# Altium schematic sheet SPItoLVDS.SchDoc: PMOD SPI <> LVDS
size Letter; Revision: 1; SheetNumber: 1; SheetTotal: 1; Client: Facebook; LeaflabsProject: Sawyer
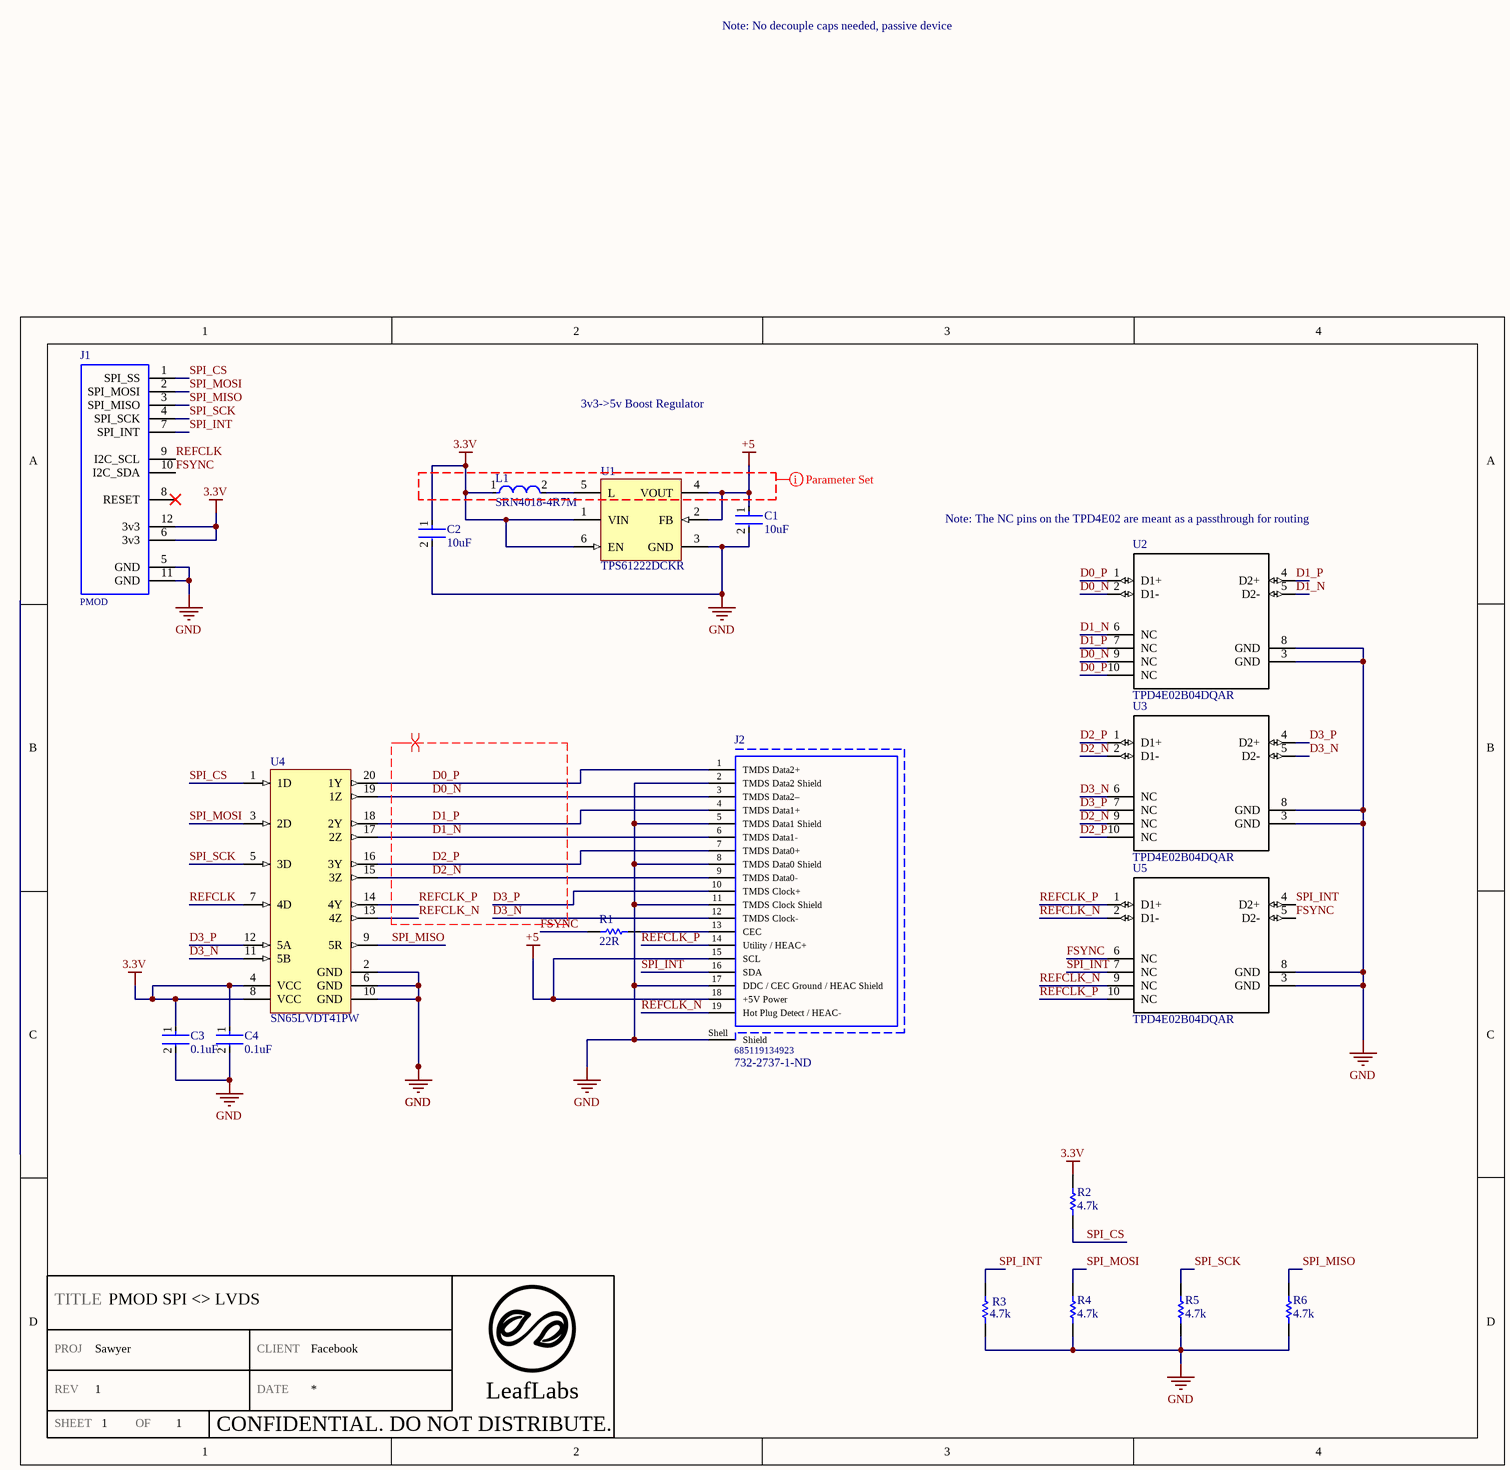
[diagram p0: SPItoLVDS.SchDoc]

## Parts
C1  10uF  [FP-CC0603-DA-IPC_B]
C2  10uF  [FP-CC0603-DA-IPC_B]
C3  0.1uF  [FP-CC0603-DA-IPC_B]
C4  0.1uF  [FP-CC0603-DA-IPC_B]
J1  PMOD  [PMOD]
J2  685119134923  Supplier Part Number 1: 732-2737-1-ND  [685119134923]
L1  SRN4018-4R7M  [FP-SRN4018-MFG]
R1  22R  [RESC1609X50X30NL10T20]
R2  4.7k  [RESC1609X50X30NL10T20]
R3  4.7k  [RESC1609X50X30NL10T20]
R4  4.7k  [RESC1609X50X30NL10T20]
R5  4.7k  [RESC1609X50X30NL10T20]
R6  4.7k  [RESC1609X50X30NL10T20]
U1  TPS61222DCKR  [SOT363_L]
U2  TPD4E02B04DQAR  [DQA0010A]
U3  TPD4E02B04DQAR  [DQA0010A]
U4  SN65LVDT41PW  [PW0020A_L]
U5  TPD4E02B04DQAR  [DQA0010A]

## Nets
3.3V: C2.1 C3.1 C4.1 J1.6(3v3) J1.12(3v3) L1.1 R2.2 U1.1(VIN) U1.6(EN) U4.4(VCC) U4.8(VCC)
+5: C1.1 J2.15(SCL) J2.18(+5V_Power) U1.2(FB) U1.4(VOUT)
GND: C1.2 C2.2 C3.2 C4.2 J1.5(GND) J1.11(GND) J2.2(TMDS_Data2_Shield) J2.5(TMDS_Data1_Shield) J2.8(TMDS_Data0_Shield) J2.11(TMDS_Clock_Shield) J2.17(DDC_/_CEC_Ground_/_HEAC_Shield) J2.Shell(Shield) R3.1 R4.1 R5.1 R6.1 U1.3(GND) U2.3(GND) U2.8(GND) U3.3(GND) U3.8(GND) U4.2(GND) U4.6(GND) U4.10(GND) U5.3(GND) U5.8(GND)
D0_N: J2.3(TMDS_Data2–) U2.2(D1-) U2.9(NC) U4.19(1Z)
D0_P: J2.1(TMDS_Data2+) U2.1(D1+) U2.10(NC) U4.20(1Y)
D1_N: J2.6(TMDS_Data1-) U2.5(D2-) U2.6(NC) U4.17(2Z)
D1_P: J2.4(TMDS_Data1+) U2.4(D2+) U2.7(NC) U4.18(2Y)
D2_N: J2.9(TMDS_Data0-) U3.2(D1-) U3.9(NC) U4.15(3Z)
D2_P: J2.7(TMDS_Data0+) U3.1(D1+) U3.10(NC) U4.16(3Y)
D3_N: J2.12(TMDS_Clock-) U3.5(D2-) U3.6(NC) U4.11(5B)
D3_P: J2.10(TMDS_Clock+) U3.4(D2+) U3.7(NC) U4.12(5A)
FSYNC: J1.10(I2C_SDA) R1.1 U5.5(D2-) U5.6(NC)
REFCLK: J1.9(I2C_SCL) U4.7(4D)
REFCLK_N: J2.19(Hot_Plug_Detect_/_HEAC-) U4.13(4Z) U5.2(D1-) U5.9(NC)
REFCLK_P: J2.14(Utility_/_HEAC+) U4.14(4Y) U5.1(D1+) U5.10(NC)
SPI_CS: J1.1(SPI_SS) R2.1 U4.1(1D)
SPI_INT: J1.7(SPI_INT) J2.16(SDA) R3.2 U5.4(D2+) U5.7(NC)
SPI_MISO: J1.3(SPI_MISO) R6.2 U4.9(5R)
SPI_MOSI: J1.2(SPI_MOSI) R4.2 U4.3(2D)
SPI_SCK: J1.4(SPI_SCK) R5.2 U4.5(3D)
NetJ2_13: J2.13(CEC) R1.2
NetL1_2: L1.2 U1.5(L)

Not connected (* = marked no-connect by the designer): J1 8(RESET)*

## Layout directives
differential pair: D0_N, D0_P, D1_N, D1_P, D2_N, D2_P, D3_N, D3_P, REFCLK_N, REFCLK_P
net class SMPS_POUR: (no net found under the mark)

## Notes on the sheet
- Note: No decouple caps needed, passive device
- 3v3->5v Boost Regulator
- Note: The NC pins on the TPD4E02 are meant as a passthrough for routing
- PROJ
- TITLE
- CLIENT
- REV
- DATE
- LeafLabs
- SHEET
- OF
- CONFIDENTIAL. DO NOT DISTRIBUTE.

## Library data of the parts
C1 C2 = CAP-0603-10uF: CAP CER 10UF 0603; ComponentLink2Description: Datasheet; Device Class L2: Capacitors; ComponentLink2URL: http://www.yageo.com/documents/recent/UPY-GPHC_X7R_6.3V-to-50V_18.pdf; Category: Cap; Supplier 1: Digi-Key; Supplier Part Number 1: 490-12736-1-ND
C3 C4 = CAP-0603-0.1UF: CAP CER 0.1UF 16V X7R 0603; Manufacturer Part Number: CC0603KRX7R7BB104; Manufacturer: YAGEO; Tolerance: 0.1; Value: 100 nF; Temperature Coefficient: 15%; Material: Ceramic; Voltage Rating: 16 V; Package: CC0603-DA; ComponentLink2Description: Datasheet; Octopart: https://octopart.com/cc0603krx7r7bb104-yageo-192941; Temperature Range High: +125°C; Digikey Description: CAP CER 0.1UF 16V X7R 0603; Voltage: 16 V; Device Class L2: Capacitors; Height: 0.9mm; Temperature: -55°C to +125°C; Device Class L1: Passive Components; Device Class L3: Ceramic Capacitors; ComponentLink2URL: http://www.yageo.com/documents/recent/UPY-GPHC_X7R_6.3V-to-50V_18.pdf; Footprint Url: http://www.yageo.com/exep/pages/download/literatures/UPY-C_GEN_24.pdf; RoHS: TRUE; Temperature Range Low: -55°C; Temperature Characteristic: X7R; Lead Free: Yes; Capacitance: 100 nF; Category: Cap; Mouser Description: Multilayer Ceramic Capacitor, CC Series, 0.1 - F, - 10%, X7R, 16 V, 0603 [1608 Metric]; Automotive: No; Supplier 1: Digi-Key; Supplier Part Number 1: 311-1088-1-ND
J1 = PMOD-TH: PMOD Connector, Through Hole, Standard pinout; Pitch: 2.54mm; Gender: Male; Pin Number: 12; Row Number: Dual; Withstanding Voltage: 500VAC; Contact Resistance: 20mOhm; Rated Current: 3A; Orientation: Angled; Publisher: WurthElektronik; Supplier 1: Digi-Key; Supplier Part Number 1: 732-5354-ND
J2 = 685119134923: HDMI Type A Receptacle WR-HDMI, Horizontal, SMT; Manufacturer: Wurth Elektronik; Contact Resistance: 30mOhm; Working Voltage: 40VDC; Rated Current: 0.5A; Publisher: WurthElektronik; Datasheet URL: https://katalog.we-online.de/em/datasheet/685119134923.pdf; Gender: Receptacle; Manufacturer URL: http://www.we-online.de; Orientation: Horizontal; Mounting Technology: SMT; Part Number: 685119134923; Packaging: TapeandReel; Package Reference: 685119134923; Operating Temperature: -20to85degC; Connector Type: HDMITypeA; Supplier 1: Digi-Key
L1 = SRN4018-4R7M: FIXED IND 4.7UH 1.9A 84 MOHM SMD; Manufacturer: Bourns; Q Factor: 9; Series Resistance: 0.084Ω; Test Frequency: 7.96MHz; Self Resonant Frequency: 35MHz; Tolerance: 20%; Core Material: Ferrite; Shielding: true; Saturation Current: 2A; Lead Free: Yes; Rms Current: 1.9A; Temperature: -40°C to +125°C; Value: 4.7uH; Inductance: 4.7uH; Device Class L1: Passive Components; Automotive: No; Octopart: https://octopart.com/srn4018-4r7m-bourns-25452396; Mouser Description: Fixed Inductors 4.7uH 20% SMD 4018; Package: SRN4018; Height: 1.8mm; Device Class L3: Fixed Inductors; ComponentLink2Description: Datasheet; Composition: Wirewound; Category: Ind; RoHS: TRUE; Manufacturer Part Number: SRN4018-4R7M; ComponentLink2URL: https://www.bourns.com/docs/Product-Datasheets/SRN4018.pdf; Temperature Range High: +125°C; Temperature Range Low: -40°C; Digikey Description: FIXED IND 4.7UH 1.9A 84 MOHM SMD; Device Class L2: Inductors; Supplier 1: Digi-Key; Supplier Part Number 1: SRN4018-4R7MCT-ND
R1 = RES-0603-22R: Resistor 0603 22 Ohm; Supplier 1: Digi-Key; Supplier Part Number 1: CR0603-JW-220ELFCT-ND
R2-R6 = RES-0603-4.7k: Resistor 0603 4.7k Ohm; Supplier 1: Digi-Key; Supplier Part Number 1: CR0603-JW-472ELFCT-ND
U1 = TPS61222DCKR: Boost Voltage Converter with 0.7 to 5.5 V Input and 5 V Output, -40 to 85 degC, 6-Pin SC70 (DCK), Green (RoHS & no Sb/Br); Manufacturer: Texas Instruments; Vout(Min)(V): 5; SubFamily: Step-Up Regulator; Vin(Min)(V): 0.7; Switching Frequency(Max)(kHz): 2000; Regulated Outputs(#): 1; Vin(Max)(V): 5.5; Topology: Boost; Vout(Max)(V): 5; PackageVersion: revG, Jan-2007; Mounting Technology: Surface Mount; ComponentLink2URL: http://www.ti.com/litv/pdf/mpds114c; PackageReference: DCK0006A; DatasheetVersion: SLVS776; PartNumber: TPS61222DCKR; ComponentLink1Description: Datasheet; ComponentLink1URL: http://www.ti.com/general/docs/lit/getliterature.tsp?genericPartNumber=TPS61222&fileType=pdf; ComponentLink2Description: Package Specification; Eco-Plan: Green (RoHS & no Sb/Br); Code_JEDEC: MO-203-AB; PackageDescription: 6-Pin Plastic Small-Outline Package, 2 x 1.3 mm Body, 0.65 mm Pitch, 2.1 mm Lead Span; Supplier 1: Digi-Key; Supplier Part Number 1: 296-39435-1-ND
U2 U3 U5 = TPD4E02B04DQAR: 4 Channel TVS Avalanch diode for USB3/HDMI2.0 protection; Manufacturer: Texas Instruments; CompType: IC; PIN_COUNT: 10; Application_BuildNumber: *; PartNumber: TPD4E02B04DQAR; PackageReference: DQA0010A; MountType: SMT; RoHS: Y; RefDes: RefDes; Type: DEV; Value: Value; Copyright: Copyright (C) 2018 Accelerated Designs. All rights reserved; Part Number: TPD4E02B04DQAR; Supplier 1: Digi-Key; Supplier Part Number 1: 296-43875-1-ND
U4 = SN65LVDT41PW: SPI<>LVDS Transceiver Interconnect Extender Chipset, -40 to +125 degC, 20-Pin TSSOP (PW), Green (RoHS & no Sb/Br); Manufacturer: Texas Instruments; SubFamily: LVDS PHY (<800Mbps); PackageDescription: 20-Pin Plastic Thin Small Outline Package 6.5 x 4.4 mm Body ,0.65 mm Pitch; ComponentLink3URL: SamplesURL:http://www.ti.com/product/sn65lvdt41-ep#samples; PackageReference: PW0020A; DatasheetVersion: SCES633; ComponentLink3Description: URL Link1; ComponentLink2Description: Datasheet; ComponentLink1URL: http://www.ti.com/; Mounting Technology: Surface Mount; Part Number: SN65LVDT41PW; ComponentLink2URL: http://www.ti.com/general/docs/lit/getliterature.tsp?genericPartNumber=SN65LVDT41-EP&fileType=pdf; ComponentLink1Description: Manufacturer URL; Eco-Plan: Green (RoHS & no Sb/Br); Supplier 1: Digi-Key; Supplier Part Number 1: 296-12738-5-ND